# EAGLE design PolarTableMotorShield (EAGLE 9.2.2)
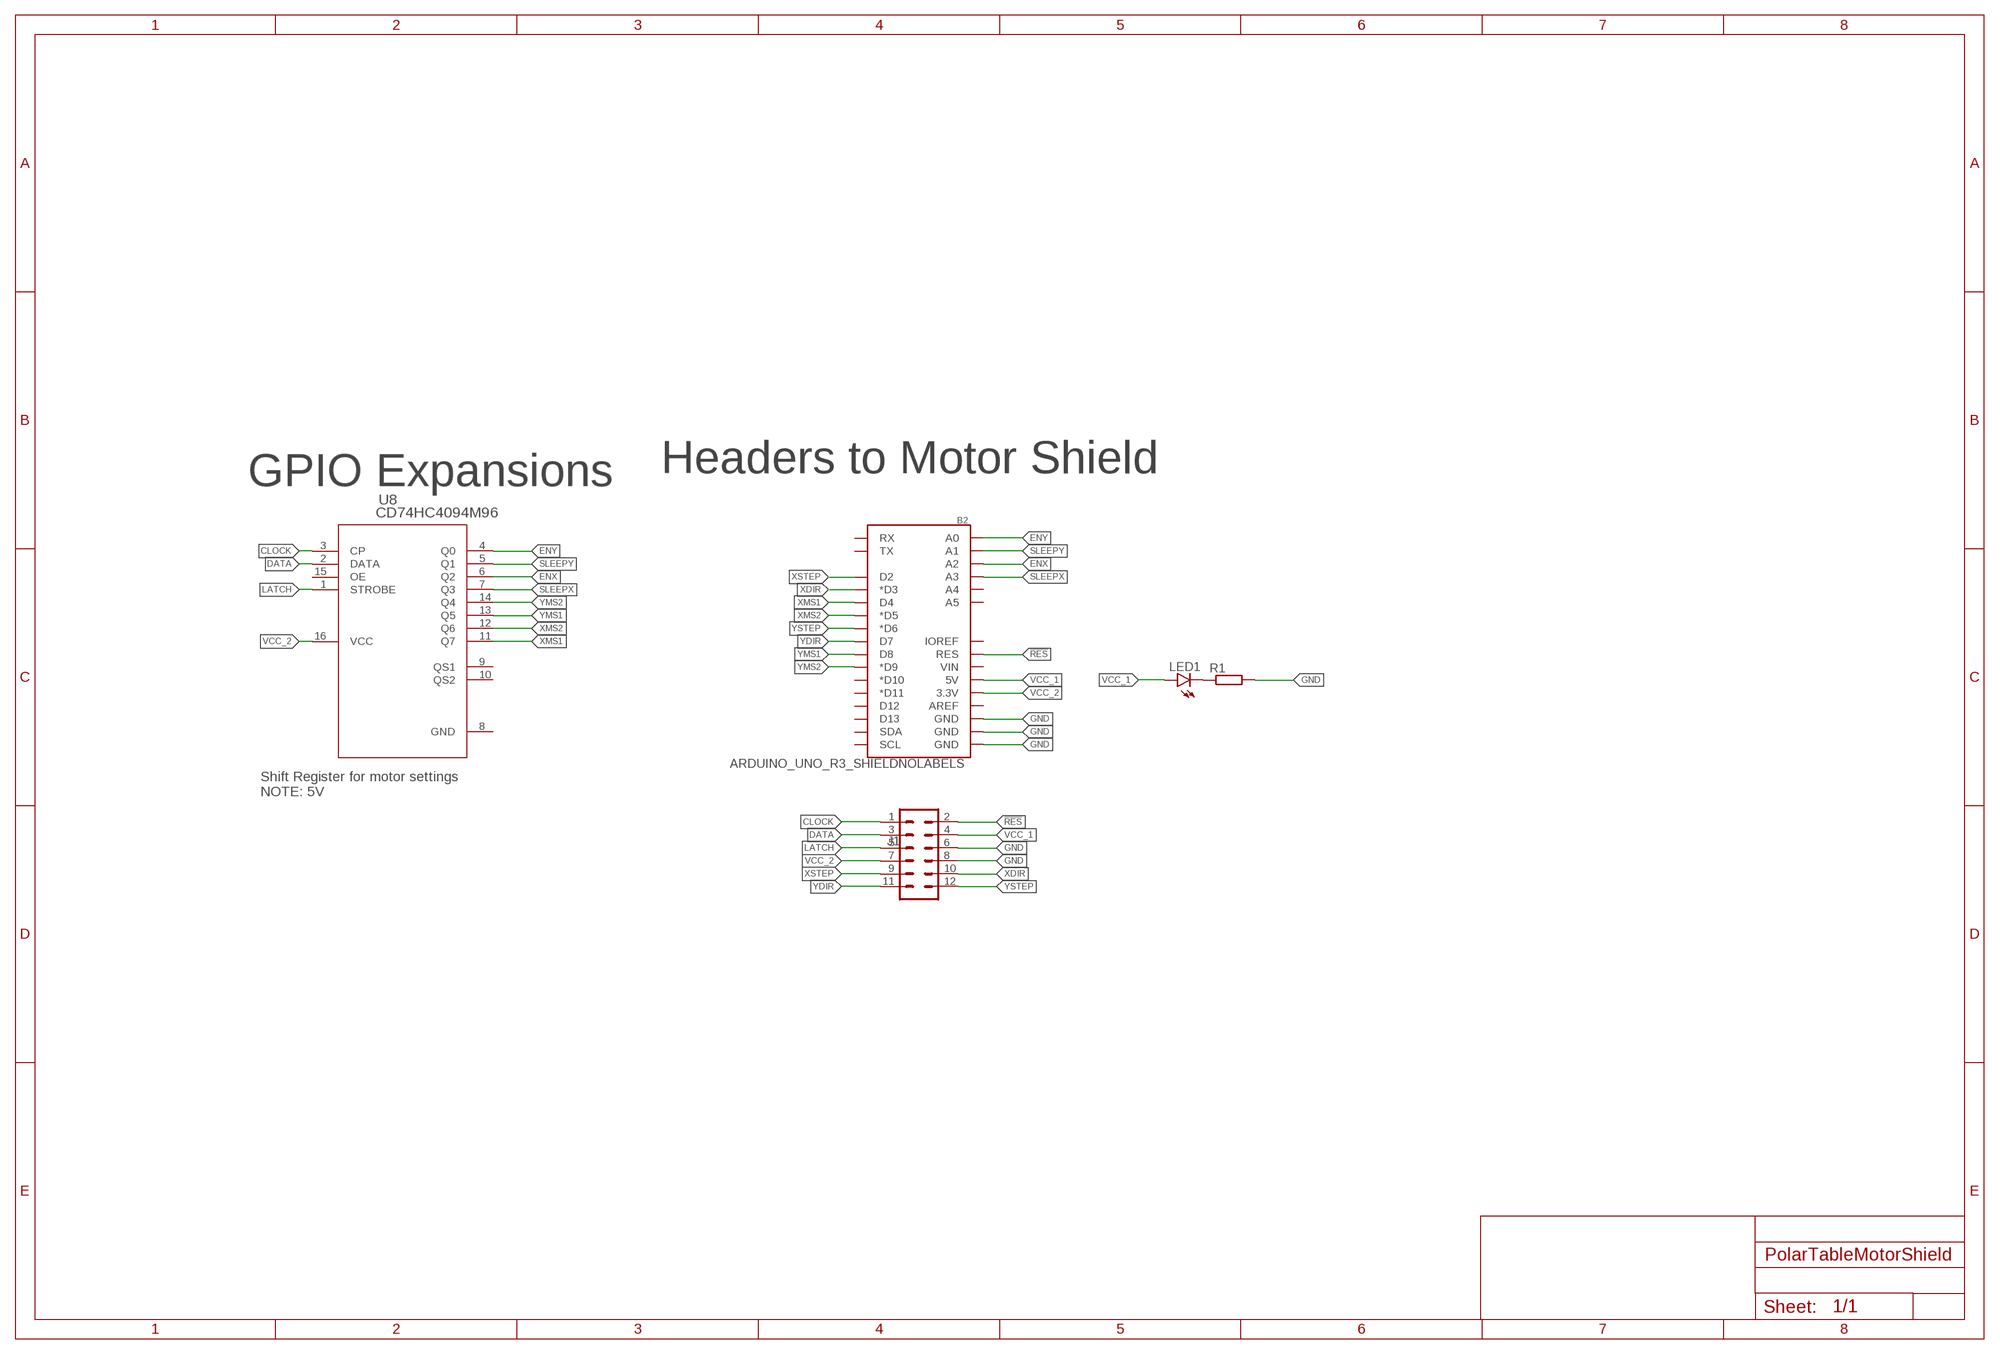
[diagram p0: schematic, sheet 1]

## Parts
B2  ARDUINO_UNO_R3_SHIELDNOLABELS  [UNO_R3_SHIELD_NOLABELS]
J1  CONN_06X21.24MM_RA_MALE  [2X6]
LED1  LEDCHIPLED_0805  [CHIPLED_0805]
R1  R-EU_R0805  [R0805]
U8  CD74HC4094M96  [D16]

## Nets
!RES [5v]: B2.RES J1.2
CLOCK [5v]: J1.1 U8.3(CP)
DATA [5v]: J1.3 U8.2(DATA)
ENX [5v]: B2.A2 U8.6(Q2)
ENY [5v]: B2.A0 U8.4(Q0)
GND [5v]: B2.GND@0(GND) B2.GND@1(GND) B2.GND@2(GND) J1.6 J1.8 R1.2
LATCH [5v]: J1.5 U8.1(STROBE)
N$1: LED1.C R1.1
SLEEPX [5v]: B2.A3 U8.7(Q3)
SLEEPY [5v]: B2.A1 U8.5(Q1)
VCC_1 [5v]: B2.5V J1.4 LED1.A
VCC_2: B2.3.3V J1.7 U8.16(VCC)
XDIR [5v]: B2.D3(*D3) J1.10
XMS1 [5v]: B2.D4 U8.11(Q7)
XMS2 [5v]: B2.D5(*D5) U8.12(Q6)
XSTEP [5v]: B2.D2 J1.9
YDIR [5v]: B2.D7 J1.11
YMS1 [5v]: B2.D8 U8.13(Q5)
YMS2 [5v]: B2.D9(*D9) U8.14(Q4)
YSTEP [5v]: B2.D6(*D6) J1.12
Unconnected: B2.A4 B2.A5 B2.AREF B2.D10(*D10) B2.D11(*D11) B2.D12 B2.D13 B2.IOREF B2.RX B2.SCL B2.SDA B2.TX B2.VIN U8.9(QS1) U8.10(QS2) U8.15(OE)

## Notes on the sheet
- GPIO Expansions | Headers to Motor Shield
- Shift Register for motor settings
  NOTE: 5V

## Power pins joined to a net without a drawn wire
GND: U8.8(GND)

## Library data of the parts
B2 = keir_library:ARDUINO_UNO_R3_SHIELD: Arduino R3 Shield Footprint Shield form compatible with the Arduino Uno R3. SparkFun Products: MG2639 Cellular Shield <https://www.sparkfun.com/products/13120> MIDI Shield <https://www.sparkfun.com/products/12898> R3 Stackable Headers Kit <https://www.sparkfun.com/products/11417>
J1 = keir_library:CONN_06X2: Multi connection point. Often used as Generic Header-pin footprint for 0.1 inch spaced/style header connections On any of the 0.1 inch spaced packages, you can populate with these: Break Away Headers - Straight <https://www.sparkfun.com/products/116> (PRT-00116) Break Away Male Headers - Right Angle <https://www.sparkfun.com/products/553> (PRT-00553) Female Headers <https://www.sparkfun.com/products/115> (PRT-00115) Break Away Headers - Machine Pin <https://www.sparkfun.com/products/117> (PRT-00117) Break Away Female Headers - Swiss Machine Pin <https://www.sparkfun.com/products/743> (PRT-00743)
LED1 = led:LED: LED OSRAM: - CHIPLED LG R971, LG N971, LY N971, LG Q971, LY Q971, LO R971, LY R971 LH N974, LH R974 LS Q976, LO Q976, LY Q976 LO Q996 - Hyper CHIPLED LW Q18S LB Q993, LB Q99A, LB R99A - SideLED LS A670, LO A670, LY A670, LG A670, LP A670 LB A673, LV A673, LT A673, LW A673 LH A674 LY A675 LS A676, LA A676, LO A676, LY A676, LW A676 LS A679, LY A679, LG A679 - Hyper Micro SIDELED® LS Y876, LA Y876, LO Y876, LY Y876 LT Y87S - SmartLED LW L88C, LW L88S LB L89C, LB L89S, LG L890 LS L89K, LO L89K, LY L89K LS L896, LA L896, LO L896, LY L896 - TOPLED LS T670, LO T670, LY T670, LG T670, LP T670 LSG T670, LSP T670, LSY T670, LOP T670, LYG T670 LG T671, LOG T671, LSG T671 LB T673, LV T673, LT T673, LW T673 LH T674 LS T676, LA T676, LO T676, LY T676, LB T676, LH T676, LSB T676, LW T676 LB T67C, LV T67C, LT T67C, LS T67K, LO T67K, LY T67K, LW E67C LS E67B, LA E67B, LO E67B, LY E67B, LB E67C, LV E67C, LT E67C LW T67C LS T679, LY T679, LG T679 LS T770, LO T770, LY T770, LG T770, LP T770 LB T773, LV T773, LT T773, LW T773 LH T774 LS E675, LA E675, LY E675, LS T675 LS T776, LA T776, LO T776, LY T776, LB T776 LHGB T686 LT T68C, LB T68C - Hyper Mini TOPLED® LB M676 - Mini TOPLED Santana® LG M470 LS M47K, LO M47K, LY M47K Source: http://www.osram.convergy.de LUXEON: - LUMILED® LXK2-PW12-R00, LXK2-PW12-S00, LXK2-PW14-U00, LXK2-PW14-V00 LXK2-PM12-R00, LXK2-PM12-S00, LXK2-PM14-U00 LXK2-PE12-Q00, LXK2-PE12-R00, LXK2-PE12-S00, LXK2-PE14-T00, LXK2-PE14-U00 LXK2-PB12-K00, LXK2-PB12-L00, LXK2-PB12-M00, LXK2-PB14-N00, LXK2-PB14-P00, LXK2-PB14-Q00 LXK2-PR12-L00, LXK2-PR12-M00, LXK2-PR14-Q00, LXK2-PR14-R00 LXK2-PD12-Q00, LXK2-PD12-R00, LXK2-PD12-S00 LXK2-PH12-R00, LXK2-PH12-S00 LXK2-PL12-P00, LXK2-PL12-Q00, LXK2-PL12-R00 Source: www.luxeon.com KINGBRIGHT: KA-3528ASYC Source: www.kingbright.com
R1 = resistor:R-EU_: RESISTOR, European symbol
U8 = keir_library:CD74HC4094M96; MANUFACTURER_PART_NUMBER: CD74HC4094M96; VENDOR: Texas Instruments

## Net classes
1 12v_Supply: width 1.2 mm, clearance 0.31 mm
2 5v_Supply: width 1 mm

## Board
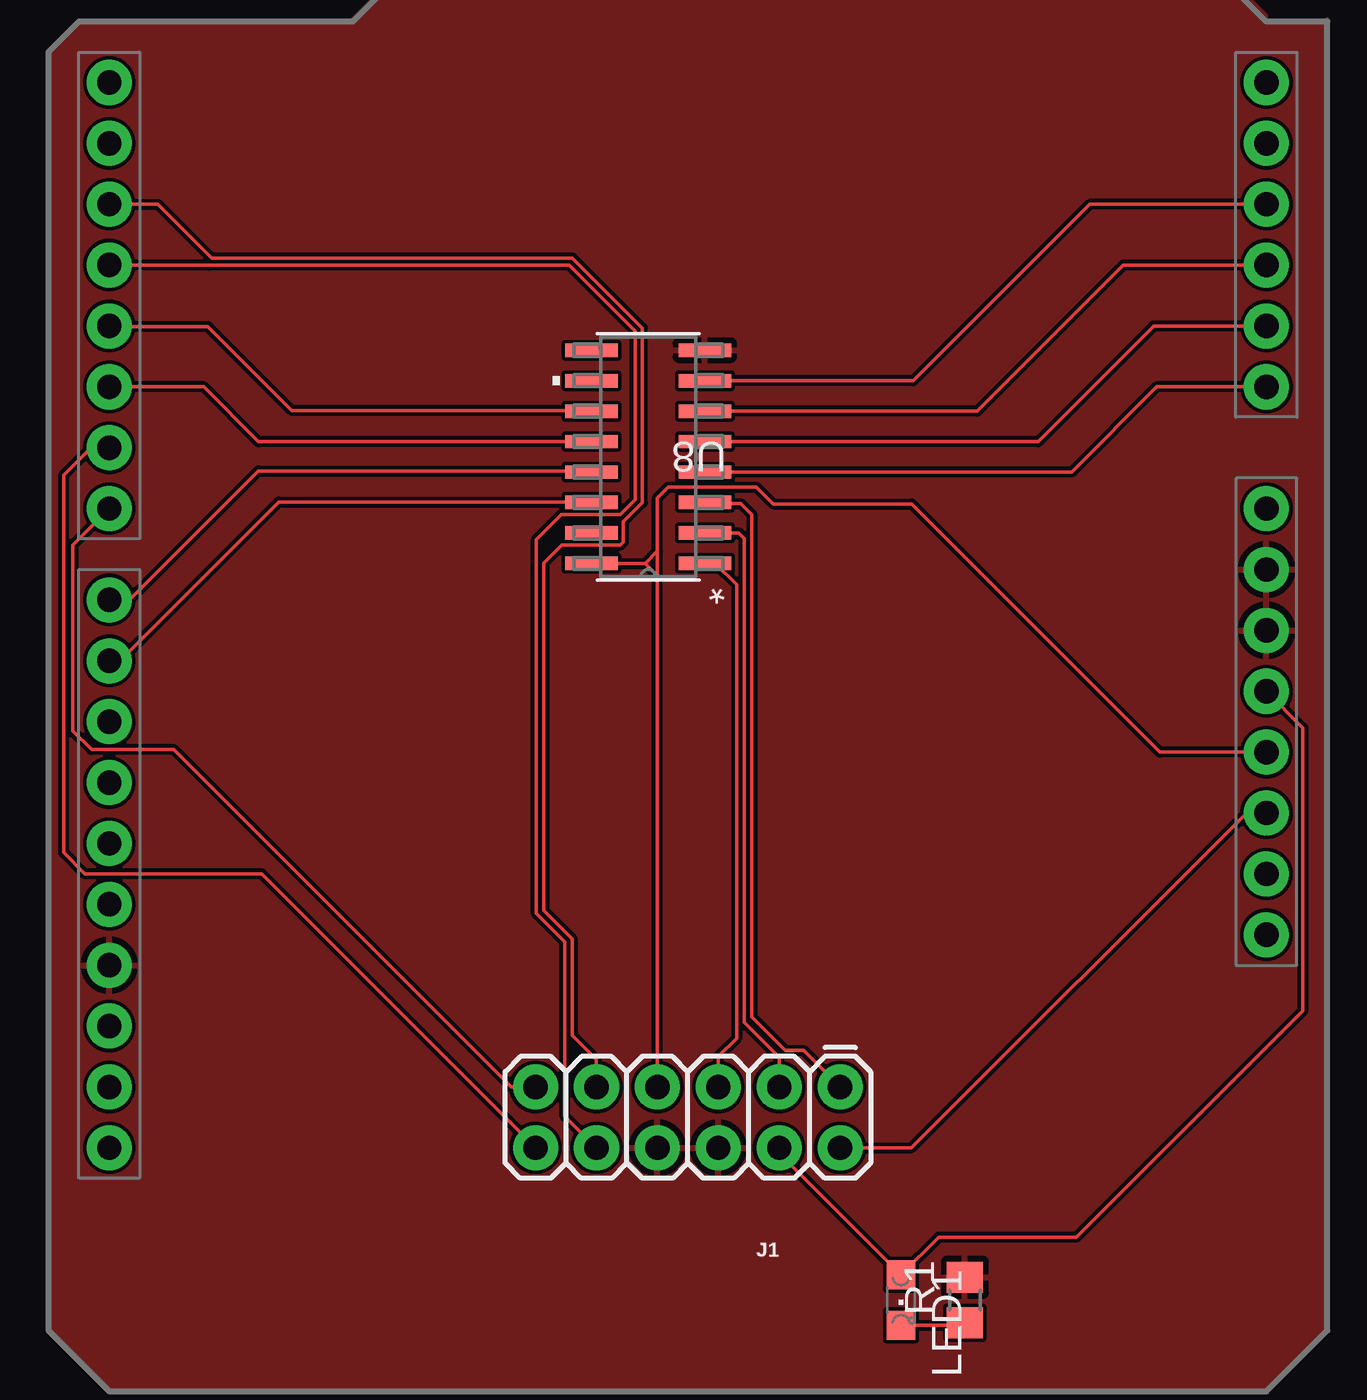
[diagram p1: board, top side]
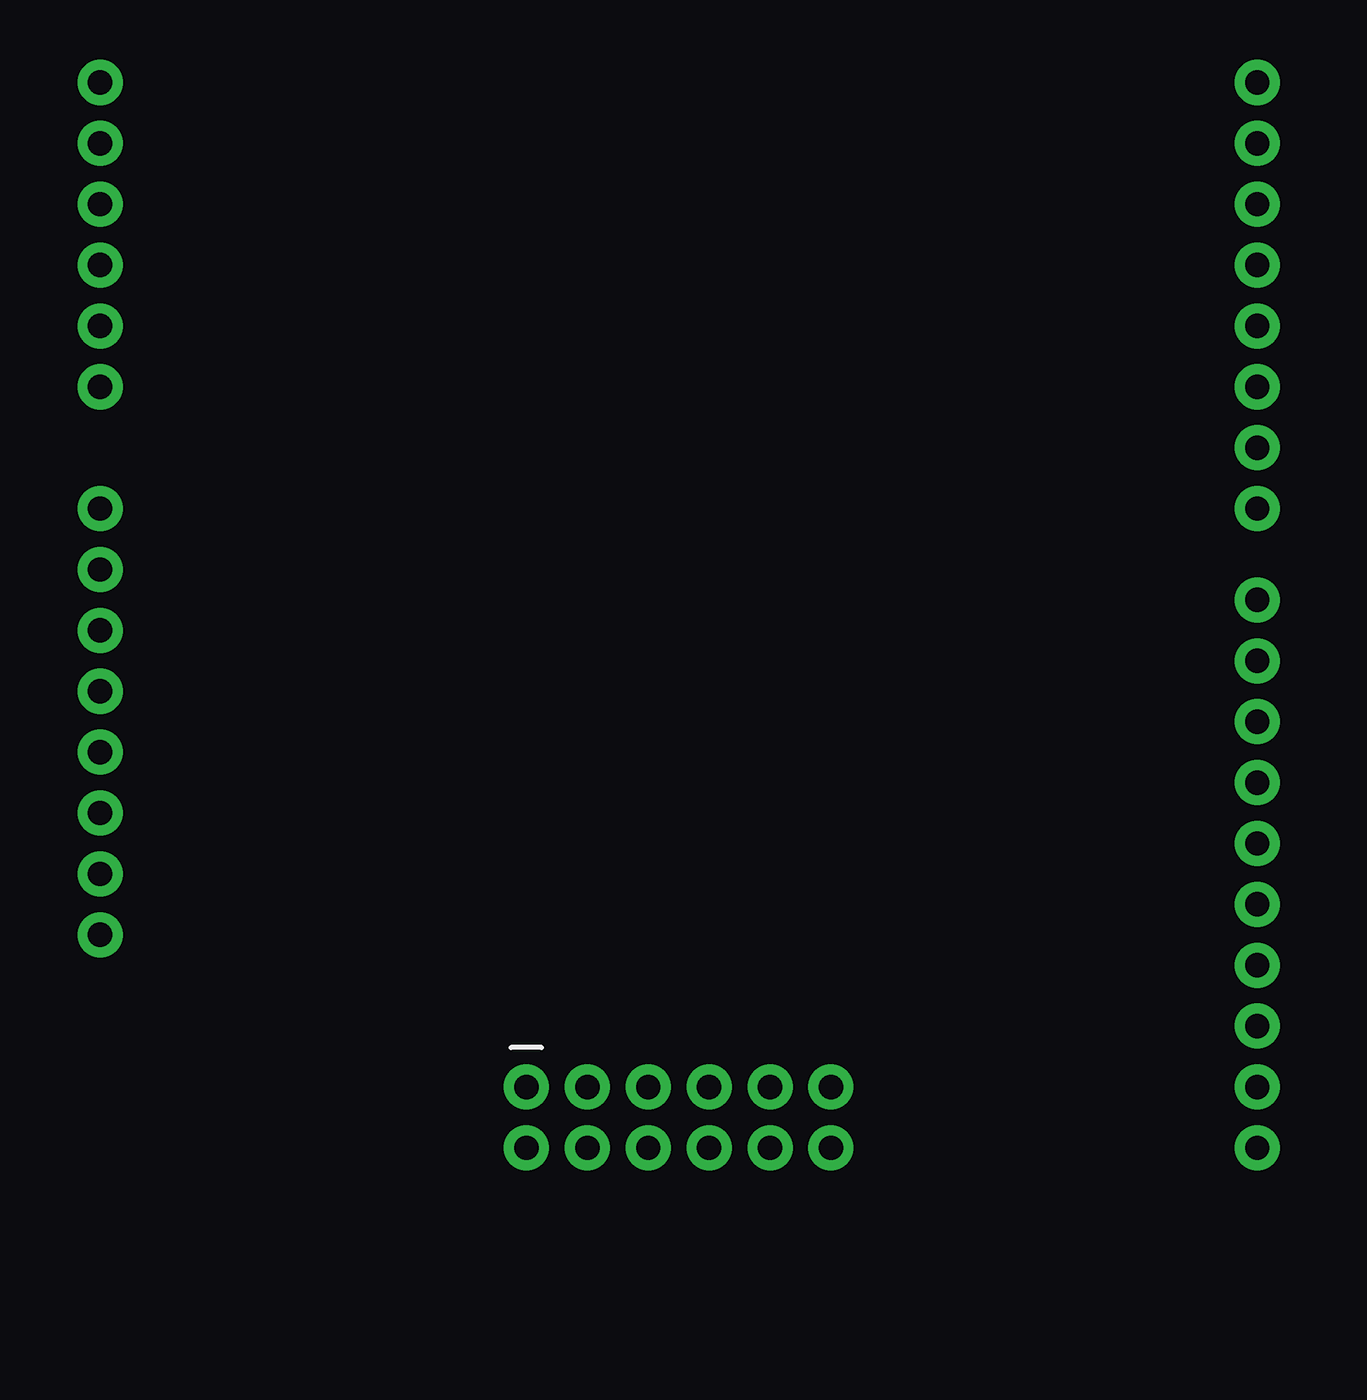
[diagram p2: board, bottom side, seen from below]

No outline drawn. Coordinates in mm, seen from the top.
Copper layers (1*16): Top 0.035559375mm / dielectric 1.6mm / Bottom 0.035559375mm
Design rules "oshpark-2layer": minimum track width 6mil, minimum drill 10mil, track to track 6mil, track to pad 6mil, pad to pad 6mil, via to via 6mil, smd to smd 6mil, copper to edge 15mil, drill to drill 6mil, minimum pad ring 5mil, minimum via ring 5mil, stop-mask expansion 2.5mil, vias tented up to drill 0mil, thermal gap 10mil

### Footprints (pad centres in the part's own frame; a part is rotated, then mirrored left to right if it is on the bottom)
UNO_R3_SHIELD_NOLABELS = drill 1.016 pad 1.88: 3.3V 24.13,-3.81; 5V 24.13,-1.27; A0 24.13,11.43; A1 24.13,13.97; A2 24.13,16.51; A3 24.13,19.05; A4 24.13,21.59; A5 24.13,24.13; AREF -24.13,-15.24; D2 -24.13,19.05; D3 -24.13,16.51; D4 -24.13,13.97; D5 -24.13,11.43; D6 -24.13,8.89; D7 -24.13,6.35; D8 -24.13,2.54; D9 -24.13,0; D10 -24.13,-2.54; D11 -24.13,-5.08; D12 -24.13,-7.62; D13 -24.13,-10.16; GND@0 24.13,1.27; GND@1 24.13,3.81; GND@2 -24.13,-12.7; IOREF 24.13,-8.89; NC 24.13,-11.43; RES 24.13,-6.35; RX -24.13,24.13; SCL -24.13,-20.32; SDA -24.13,-17.78; TX -24.13,21.59; VIN 24.13,6.35
2X6 = drill 1.016 pad 1.88: 1 0,0; 2 0,2.54; 3 2.54,0; 4 2.54,2.54; 5 5.08,0; 6 5.08,2.54; 7 7.62,0; 8 7.62,2.54; 9 10.16,0; 10 10.16,2.54; 11 12.7,0; 12 12.7,2.54
CHIPLED_0805 = smd 1.2 x 1.2: A 0,-1.05; C 0,1.05
R0805 = smd 1.3 x 1.5: 1 -0.95,0; 2 0.95,0
D16 = smd 2.184 x 0.559: 1 -2.362,4.445; 2 -2.362,3.175; 3 -2.362,1.905; 4 -2.362,0.635; 5 -2.362,-0.635; 6 -2.362,-1.905; 7 -2.362,-3.175; 8 -2.362,-4.445; 9 2.362,-4.445; 10 2.362,-3.175; 11 2.362,-1.905; 12 2.362,-0.635; 13 2.362,0.635; 14 2.362,1.905; 15 2.362,3.175; 16 2.362,4.445

### Placement (x,y rotation side)
B2  26.67,30.48 0 top
J1  33.02,12.7 180 top
LED1  35.56,3.81 180 top
R1  38.23,3.81 90 top
U8  25.02,38.99 180 top

### Tracks (layer width: path | path; a pad name or v marks a point on that pad's centre or on a via)
!RES
  Top 0.152: B2.RES 50.75,24.08 49.91,24.08 35.99,10.16 J1.2
CLOCK
  Top 0.152: U8.3 27.43,37.03 28.88,37.03 29.34,36.58 29.34,15.62 30.73,14.22 31.5,14.22 J1.1
DATA
  Top 0.152: U8.2 28.8,35.81 29.03,35.59 29.03,15.39 30.48,13.95 J1.3
ENX
  Top 0.152: B2.A2 44.83,46.99 38.73,40.89 U8.6
ENY
  Top 0.152: U8.4 42.67,38.35 46.23,41.91 B2.A0
GND
  pour Top: 0,2.54 0,55.88 1.27,57.15 12.57,57.15 15.11,59.69 15.24,59.69 48.51,59.69 50.8,57.4 50.8,57.02 53.09,57.02 53.34,57.28 53.34,2.54 50.8,0 2.54,0
LATCH
  Top 0.152: U8.1 27.43,34.52 27.84,34.52 28.7,33.66 28.7,14.73 27.94,13.97 J1.5
N$1
  Top 0.152: LED1.C 38.13,2.76 R1.1
SLEEPX
  Top 0.152: B2.A3 43.43,49.53 36.07,42.16 U8.7
SLEEPY
  Top 0.152: B2.A1 46.1,44.45 41.27,39.62 U8.5
VCC_1
  Top 0.152: 49.99,29.18 50.75,29.18 B2.5V 52.32,27.69 52.32,15.88 42.88,6.43 37.13,6.43 LED1.A 30.48,9.94 J1.4
VCC_2
  Top 0.152: 25.4,12.32 J1.7 25.4,34.04 | 50.29,26.67 B2.3.3V 46.35,26.67 36.01,37.02 30.23,37.02 29.53,37.72 25.85,37.72 25.4,37.27 25.4,35.05 | 23.75,34.54 U8.16 | U8.16 23.51,34.54 | 25.4,34.04 25.4,35.05 | U8.16 24.89,34.54 | 24.89,34.54 25.4,34.04 | 24.89,34.54 25.4,35.05
XDIR
  Top 0.152: B2.D3 6.68,46.99 6.69,46.98 21.73,46.98 24.47,44.24 24.47,37.2 23.84,36.58 21.4,36.58 20.35,35.53 20.35,19.94 21.54,18.75 21.54,11.48 J1.10
XMS1
  Top 0.152: U8.11 22.63,40.92 10.16,40.92 6.66,44.42 2.59,44.42 B2.D4
XMS2
  Top 0.152: U8.12 8.76,39.62 6.48,41.91 B2.D5
XSTEP
  Top 0.152: B2.D2 4.57,49.53 6.82,47.28 21.86,47.28 24.77,44.36 24.77,37.08 23.98,36.28 23.98,35.44 23.84,35.31 21.41,35.31 20.66,34.55 20.66,20.07 21.84,18.88 21.84,14.86 22.86,13.84 J1.9
YDIR
  Top 0.152: B2.D7 1.02,35.31 1.02,27.56 1.8,26.77 5.23,26.77 19.3,12.7 J1.11
YMS1
  Top 0.152: U8.13 22.63,38.41 8.76,38.41 3.43,33.07 2.59,33.07 B2.D8
YMS2
  Top 0.152: B2.D9 2.97,30.48 9.6,37.11 22.63,37.11 U8.14
YSTEP
  Top 0.152: B2.D6 1.78,39.37 0.64,38.23 0.64,22.48 1.52,21.59 8.89,21.59 J1.12

### Text on the board
tValues: Valid combinations: | 168V / 3.3V Reg / 8MHz | 168 / 5V Reg / 16MHz | 168 / 5V Reg / 20MHz | Mark back accordingly | Arduino Pro Mini